# Altium schematic sheet 5V_Regulation.SchDoc
size A1
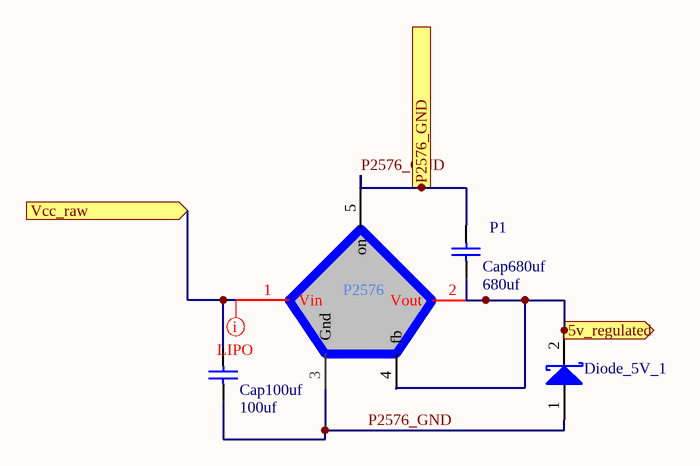
[diagram p0: 5V_Regulation.SchDoc]

## Parts
C_5V_1  Cap680uf  value 680uf  [Cap_small]
C_5V_2  Cap100uf  value 100uf  [Cap_small]
Diode_5V_1  D Schottky  [SCHOTKY_PMEG6_SOD128]  (value not drawn)
P1  P2576  [P2576]  (value not drawn)

## Ports
5v_regulated (out), P2576_GND (in), Vcc_raw (in)

## Nets
5v_regulated: C_5V_1.1 Diode_5V_1.2(K) P1.2(Vout) P1.4(fb) ; port 5v_regulated
P2576_GND: C_5V_1.2 C_5V_2.1 Diode_5V_1.1(A) P1.3(Gnd) P1.5(on) ; port P2576_GND
Vcc_raw: C_5V_2.2 P1.1(Vin) ; port Vcc_raw

## Layout directives
net class LIPO; rule Routing Layers [TopLayer - Enabled BottomLayer - Enabled ]; rule Width Constraint [Pref Width = 35mil    Min Width = 35mil    Max Width = 40mil]: Vcc_raw

## Library data of the parts
C_5V_1 C_5V_2 = Cap: Capacitor; Published: 8-Jun-2000; LatestRevisionDate: 17-Jul-2002; LatestRevisionNote: Re-released for DXP Platform.; PackageReference: RAD-0.3; Publisher: Altium Limited; PackageDescription: Radial Cap, Thru-Hole; 2 Leads; 0.3 in Pin Spacing
Diode_5V_1 = D Schottky: Schottky Diode; Published: 8-Jun-2000; LatestRevisionDate: 17-Jul-2002; LatestRevisionNote: Re-released for DXP Platform.; PackageReference: SMB; Publisher: Altium Limited; PackageDescription: DO-214-AA/SMB; 2 C-Bend Leads; Body 5.3 x 3.6 mm, inc. leads (LxW); Code_JEDEC: DO-214-AA
P1 = P2576L-12-TA5